# Altium project Detector_Board.PrjPcb
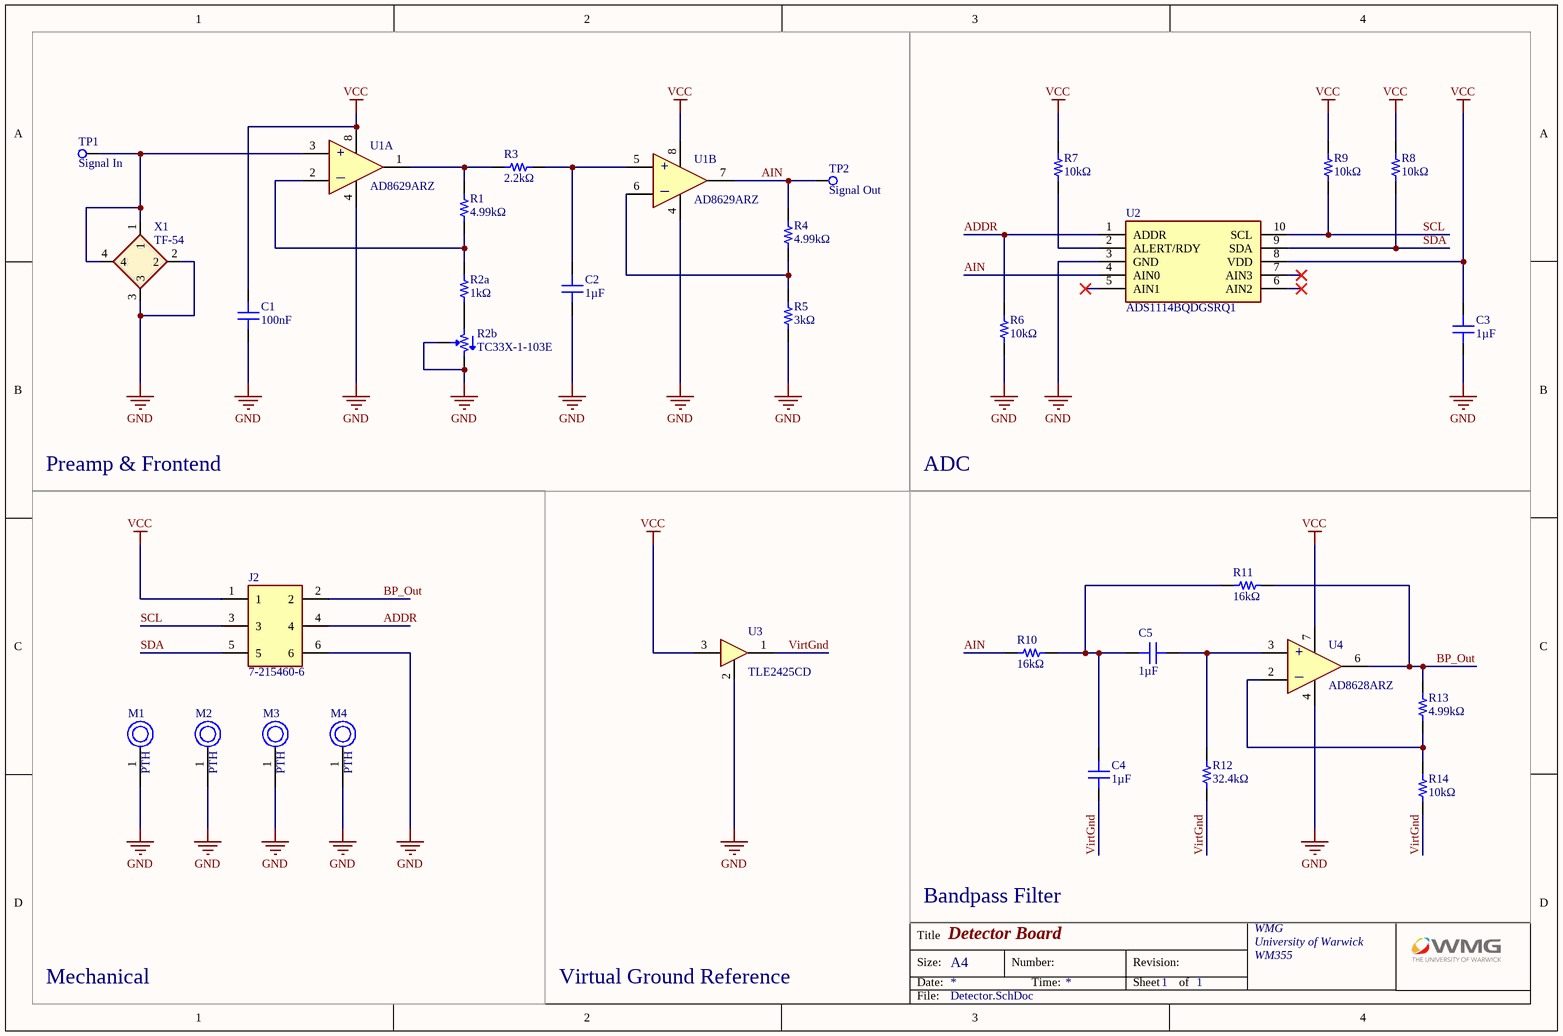
[diagram p0: Detector.SchDoc]
1 sheet, 32 parts. Net scope: global (net labels, ports and power ports of the same name join across sheets).
Board file: Detector.PcbDoc

## Sheet Detector.SchDoc: Detector Board
size A4; Organization: WMG; Address1: University of Warwick; Address2: WM355; SheetNumber: 1; SheetTotal: 1

### Parts
C1  100nF  [CAP 0603_1608]
C2  1µF  [CAP 0603_1608]
C3  1µF  [CAP 0603_1608]
C4  1µF  [CAP 0603_1608]
C5  1µF  [CAP 0603_1608]
J2  7-215460-6  [72154606]
M1  PTH  [M2-PTH]
M2  PTH  [M2-PTH]
M3  PTH  [M2-PTH]
M4  PTH  [M2-PTH]
R1  4.99kΩ  [RES 0603_1608]
R2a  1kΩ  [RES 0603_1608]
R2b  TC33X-1-103E  [TC33X2201E]
R3  2.2kΩ  [RES 0603_1608]
R4  4.99kΩ  [RES 0603_1608]
R5  3kΩ  [RES 0603_1608]
R6  10kΩ  [RES 0603_1608]
R7  10kΩ  [RES 0603_1608]
R8  10kΩ  [RES 0603_1608]
R9  10kΩ  [RES 0603_1608]
R10  16kΩ  [RES 0603_1608]
R11  16kΩ  [RES 0603_1608]
R12  32.4kΩ  [RES 0603_1608]
R13  4.99kΩ  [RES 0603_1608]
R14  10kΩ  [RES 0603_1608]
TP1  Signal In  [TP-SMD-50mil]
TP2  Signal Out  [TP-SMD-50mil]
U1  AD8629ARZ  [SOIC127P600X175-8N]  (parts A,B of 2)
U2  ADS1114BQDGSRQ1  [SOP50P490X110-10N]
U3  TLE2425CD  [SOIC127P600X175-8N]
U4  AD8628ARZ  [SOIC127P600X175-8N]
X1  TF-54  [TF-54]

### Blocks framed on the sheet
Preamp & Frontend: C1 C2 R1 R2a R2b R3-R5 TP1 TP2 U1 X1
ADC: C3 R6-R9 U2

### Nets
GND: C1.1 C2.1 C3.1 J2.6 M1.1 M2.1 M3.1 M4.1 R2b.2(WIPER) R2b.3(CW) R5.1 R6.1 U1.4(V-) U2.3(GND) U3.2(COMMON) U4.4(V-) X1.2 X1.3
VCC: C1.2 C3.2 J2.1 R7.2 R8.2 R9.2 U1.8(V+) U2.8(VDD) U3.3(IN) U4.7(V+)
ADDR: J2.4 R6.2 U2.1(ADDR)
AIN: R4.2 R10.1 TP2.1(TP) U1.7(OUT_B) U2.4(AIN0)
BP_Out: J2.2 R11.1 R13.2 U4.6(OUT)
SCL: J2.3 R9.1 U2.10(SCL)
SDA: J2.5 R8.1 U2.9(SDA)
VirtGnd: C4.1 R12.2 R14.1 U3.1(OUT)
NetC2_2: C2.2 R3.2 U1.5(+IN_B)
NetC4_2: C4.2 C5.2 R10.2 R11.2
NetC5_1: C5.1 R12.1 U4.3(+IN)
NetR1_1: R1.1 R2a.2 U1.2(-IN_A)
NetR1_2: R1.2 R3.1 U1.1(OUT_A)
NetR2a_1: R2a.1 R2b.1(CCW)
NetR4_1: R4.1 R5.2 U1.6(-IN_B)
NetR7_1: R7.1 U2.2(ALERT/RDY)
NetR13_1: R13.1 R14.2 U4.2(-IN)
NetTP1_1: TP1.1(TP) U1.3(+IN_A) X1.1 X1.4

Not connected (* = marked no-connect by the designer): U2 5(AIN1)* 6(AIN2)* 7(AIN3)*

### Notes on the sheet
- Bandpass Filter
- Mechanical
- Virtual Ground Reference
- Title
- Size:
- Date:
- A4
- Number:
- Time:
- Revision:
- Sheet
- of
- File:
- (in symbol AD8628ARZ) +; _
- (in symbol AD8629ARZ, part A) +; _
- (in symbol AD8629ARZ, part B) +; _

### Library data of the parts
C1-C5 = Capacitor: SMT Capacitor
  C1: VALUE: 100nF
  C2-C5: VALUE: 1µF
J2 = 7-215460-6: Micro-Match Connector Female 6-Way; Manufacturer_Name: TE Connectivity; Datasheet Link: https://www.te.com/commerce/DocumentDelivery/DDEController?Action=srchrtrv&DocNm=4-1773457-1_050_Micro_MaTch&DocType=Data+Sheet&DocLang=English&PartCntxt=7-215460-6&DocFormat=pdf; Height: 6mm; Manufacturer_Part_Number: 7-215460-6; Mouser Part Number: 571-7-215460-6; Mouser Price/Stock: https://www.mouser.co.uk/ProductDetail/TE-Connectivity/7-215460-6/?qs=XAKIUOoRPe4W4KMZv%2FpWzg%3D%3D; Arrow Part Number: 7-215460-6; Arrow Price/Stock: https://www.arrow.com/en/products/7-215460-6/te-connectivity; System: Connector
M1-M4 = PTH: Mounting Hole (Plated, Exposed Pad)
R1 R2a R3-R14 = Resistor: SMT Resistor
  R1 R4 R13: VALUE: 4.99kΩ
  R2a: VALUE: 1kΩ
  R3: VALUE: 2.2kΩ
  R5: VALUE: 3kΩ
  R6-R9 R14: VALUE: 10kΩ
  R10 R11: VALUE: 16kΩ
  R12: VALUE: 32.4kΩ
R2b = TC33X-1-103E: SMD Trim Potentiometer; Manufacturer_Name: Bourns; Datasheet Link: https://www.bourns.com/pdfs/TC33.pdf; Manufacturer_Part_Number: TC33X-1-103E; Mouser Part Number: 652-TC33X-1-103E; Mouser Price/Stock: https://www.mouser.co.uk/ProductDetail/Bourns/TC33X-1-103E?qs=4vvWAaIu%2Fq5rtw%252Bjip48Mw%3D%3D; Arrow Part Number: TC33X-1-103E; Arrow Price/Stock: https://www.arrow.com/en/products/tc33x-1-103e/bourns?region=nac
TP1 TP2 = Test Point
U1 = AD8629ARZ: Zero-Drift Rail-to-Rail Op-Amp (Dual); Manufacturer_Name: Analog Devices; Datasheet Link: http://componentsearchengine.com/Datasheets/1/AD8629ARZ.pdf; Height: 1.75mm; Manufacturer_Part_Number: AD8629ARZ; Mouser Part Number: 584-AD8629ARZ; Mouser Price/Stock: https://www.mouser.co.uk/ProductDetail/Analog-Devices/AD8629ARZ?qs=%2FtpEQrCGXCz303nvavA3PQ%3D%3D; Arrow Part Number: AD8629ARZ; Arrow Price/Stock: https://www.arrow.com/en/products/ad8629arz/analog-devices?region=nac
U2 = ADS1114BQDGSRQ1: I2C 16-Bit ADC; Manufacturer_Name: Texas Instruments; Datasheet Link: http://www.ti.com/lit/gpn/ads1114-q1; Height: 1.1mm; Manufacturer_Part_Number: ADS1114BQDGSRQ1; Mouser Part Number: 595-ADS1114BQDGSRQ1; Mouser Price/Stock: https://www.mouser.co.uk/ProductDetail/Texas-Instruments/ADS1114BQDGSRQ1?qs=34RfhUjJmKcBhGeHOMIUqQ%3D%3D; Arrow Part Number: ADS1114BQDGSRQ1; Arrow Price/Stock: https://www.arrow.com/en/products/ads1114bqdgsrq1/texas-instruments?region=nac
U3 = TLE2425CD: Virtual Ground Reference; Manufacturer_Name: Texas Instruments; Datasheet Link: http://www.ti.com/lit/ds/symlink/tle2425.pdf; Height: 1.75mm; Manufacturer_Part_Number: TLE2425CD; Mouser Part Number: 595-TLE2425CD; Mouser Price/Stock: https://www.mouser.co.uk/ProductDetail/Texas-Instruments/TLE2425CD?qs=5BZzbFV4k2uGRCYCE5HEfQ%3D%3D; Arrow Part Number: TLE2425CD; Arrow Price/Stock: https://www.arrow.com/en/products/tle2425cd/texas-instruments
U4 = AD8628ARZ: Zero-Drift Rail-to-Rail Op-Amp; Manufacturer_Name: Analog Devices; Datasheet Link: https://www.mouser.in/datasheet/2/609/AD8628_8629_8630-1502219.pdf; Height: 1.75mm; Manufacturer_Part_Number: AD8628ARZ; Mouser Part Number: 584-AD8628ARZ; Mouser Price/Stock: https://www.mouser.co.uk/ProductDetail/Analog-Devices/AD8628ARZ?qs=%2FtpEQrCGXCxYn1FPBdRPTA%3D%3D; Arrow Part Number: AD8628ARZ; Arrow Price/Stock: https://www.arrow.com/en/products/ad8628arz/analog-devices?region=nac
X1 = TF-54: TF-54 Socket from Fischer Elektronik

## Assembly variants
[Alternate Components]: alternate parts X1 -> TF-184, R2b -> 3362P-1-103LF, U3 -> TLE2426CLP